# EAGLE schematic wordClock (EAGLE 6.3)
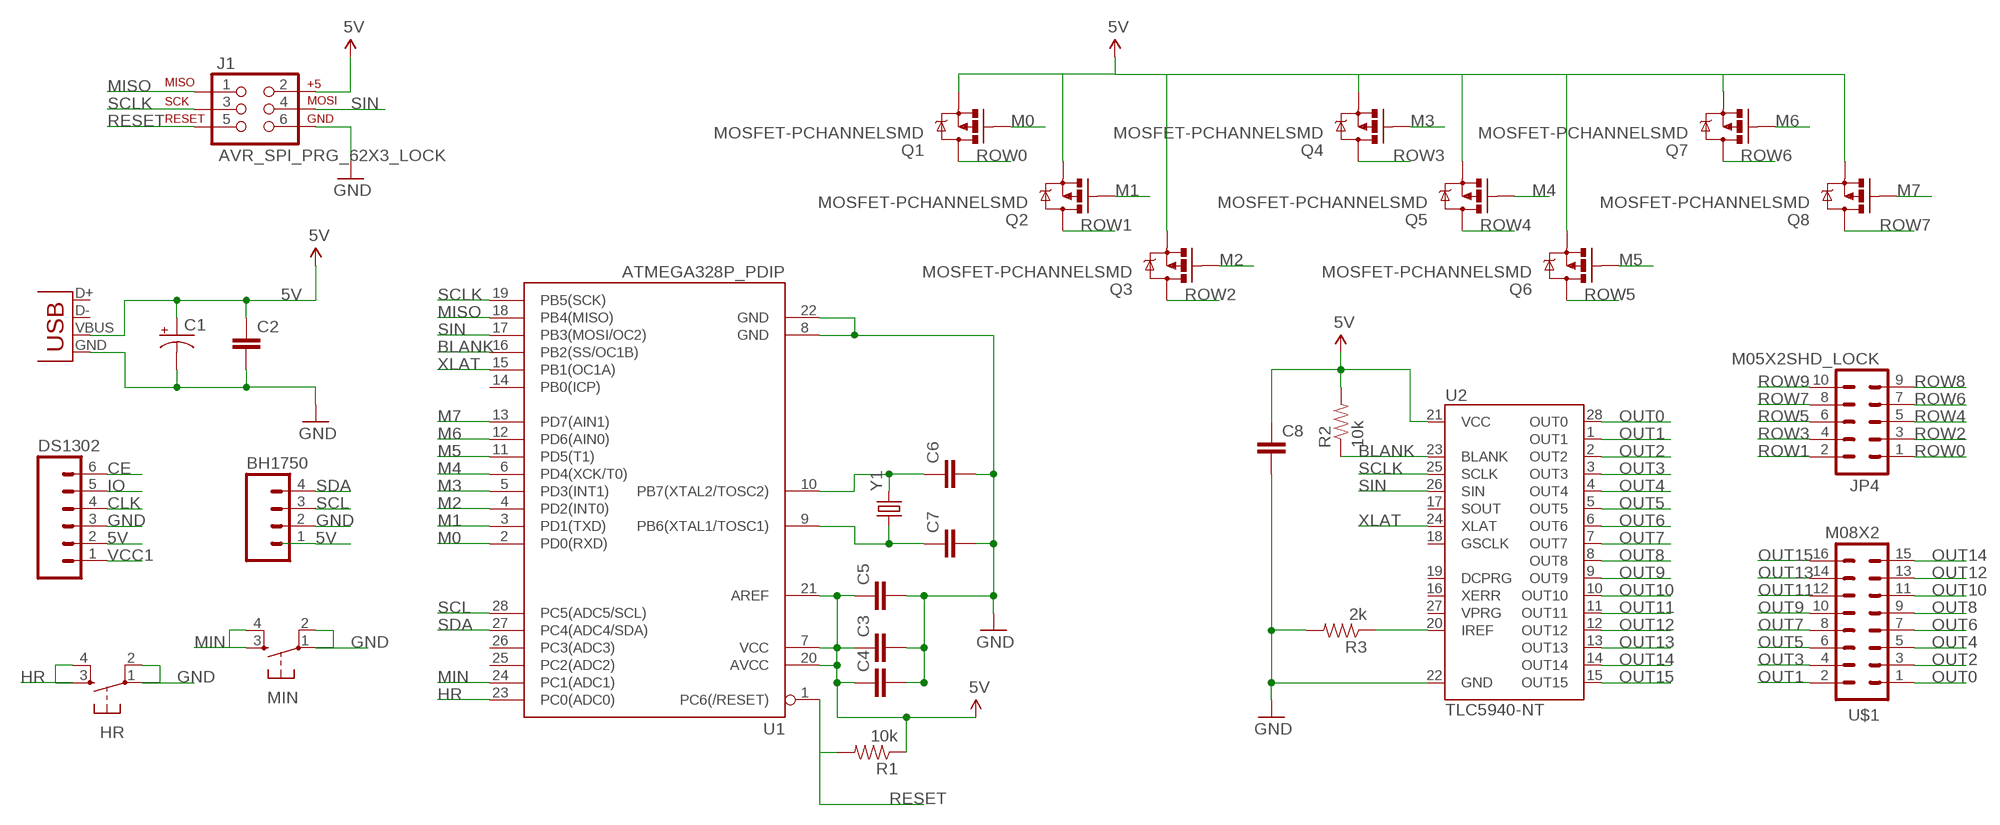
[diagram p0: schematic, sheet 1]

## Parts
BH1750  M04LOCK  [1X04_LOCK]
C1  CAP_POLD  [PANASONIC_D]
C2  CAP0805  [0805]
C3  CAP0805  [0805]
C4  CAP0805  [0805]
C5  CAP0805  [0805]
C6  CAP0805  [0805]
C7  CAP0805  [0805]
C8  CAP0805  [0805]
DS1302  M06LOCK  [1X06_LOCK]
HR  TAC_SWITCHPTH  [TACTILE-PTH]
J1  AVR_SPI_PRG_62X3_LOCK  [2X3_LOCK]
JP1  USBPTH-VERTICAL  [USB-B-PTH-VERTICAL]
JP4  M05X2SHD_LOCK  [2X5-SHROUDED_LOCK]
MIN  TAC_SWITCHPTH  [TACTILE-PTH]
Q1  MOSFET-PCHANNELSMD  [SOT23-3]
Q2  MOSFET-PCHANNELSMD  [SOT23-3]
Q3  MOSFET-PCHANNELSMD  [SOT23-3]
Q4  MOSFET-PCHANNELSMD  [SOT23-3]
Q5  MOSFET-PCHANNELSMD  [SOT23-3]
Q6  MOSFET-PCHANNELSMD  [SOT23-3]
Q7  MOSFET-PCHANNELSMD  [SOT23-3]
Q8  MOSFET-PCHANNELSMD  [SOT23-3]
R1  10k  RESISTOR0805-RES  [0805]
R2  10k  RESISTOR0805-RES  [0805]
R3  2k  RESISTOR0805-RES  [0805]
U1  ATMEGA328P_PDIP  [DIL28-3]
U2  TLC5940-NT  [DIL28-3]
U$1  M08X2  [2X8]
Y1  CRYSTALSMD  [HC49UP]

## Nets
5V: BH1750.1 C1.+ C2.1 C3.1 C4.1 C5.1 C8.1 DS1302.2 J1.2 JP1.VBUS Q1.2(S) Q2.2(S) Q3.2(S) Q4.2(S) Q5.2(S) Q6.2(S) Q7.2(S) Q8.2(S) R1.1 R2.2 U1.7(VCC) U1.20(AVCC) U1.21(AREF) U2.21(VCC)
BLANK: R2.1 U1.16(PB2(SS/OC1B)) U2.23(BLANK)
CE: DS1302.6
CLK: DS1302.4
GND: BH1750.2 C1.- C2.2 C3.2 C4.2 C5.2 C6.2 C7.2 C8.2 DS1302.3 HR.1 HR.2 J1.6 JP1.GND MIN.1 MIN.2 R3.2 U1.8(GND) U1.22(GND) U2.22(GND)
HR: HR.3 HR.4 U1.23(PC0(ADC0))
IO: DS1302.5
M0: Q1.1(G) U1.2(PD0(RXD))
M1: Q2.1(G) U1.3(PD1(TXD))
M2: Q3.1(G) U1.4(PD2(INT0))
M3: Q4.1(G) U1.5(PD3(INT1))
M4: Q5.1(G) U1.6(PD4(XCK/T0))
M5: Q6.1(G) U1.11(PD5(T1))
M6: Q7.1(G) U1.12(PD6(AIN0))
M7: Q8.1(G) U1.13(PD7(AIN1))
MIN: MIN.3 MIN.4 U1.24(PC1(ADC1))
MISO: J1.1 U1.18(PB4(MISO))
N$1: R3.1 U2.20(IREF)
N$2: C6.1 U1.10(PB7(XTAL2/TOSC2)) Y1.2
N$4: C7.1 U1.9(PB6(XTAL1/TOSC1)) Y1.1
OUT0: U2.28(OUT0) U$1.1
OUT1: U2.1(OUT1) U$1.2
OUT2: U2.2(OUT2) U$1.3
OUT3: U2.3(OUT3) U$1.4
OUT4: U2.4(OUT4) U$1.5
OUT5: U2.5(OUT5) U$1.6
OUT6: U2.6(OUT6) U$1.7
OUT7: U2.7(OUT7) U$1.8
OUT8: U2.8(OUT8) U$1.9
OUT9: U2.9(OUT9) U$1.10
OUT10: U2.10(OUT10) U$1.11
OUT11: U2.11(OUT11) U$1.12
OUT12: U2.12(OUT12) U$1.13
OUT13: U2.13(OUT13) U$1.14
OUT14: U2.14(OUT14) U$1.15
OUT15: U2.15(OUT15) U$1.16
RESET: J1.5 R1.2 U1.1(PC6(/RESET))
ROW0: JP4.1 Q1.3(D)
ROW1: JP4.2 Q2.3(D)
ROW2: JP4.3 Q3.3(D)
ROW3: JP4.4 Q4.3(D)
ROW4: JP4.5 Q5.3(D)
ROW5: JP4.6 Q6.3(D)
ROW6: JP4.7 Q7.3(D)
ROW7: JP4.8 Q8.3(D)
ROW8: JP4.9
ROW9: JP4.10
SCL: BH1750.3 U1.28(PC5(ADC5/SCL))
SCLK: J1.3 U1.19(PB5(SCK)) U2.25(SCLK)
SDA: BH1750.4 U1.27(PC4(ADC4/SDA))
SIN: J1.4 U1.17(PB3(MOSI/OC2)) U2.26(SIN)
VCC1: DS1302.1
XLAT: U1.15(PB1(OC1A)) U2.24(XLAT)
Unconnected: JP1.D+ JP1.D- U1.14(PB0(ICP)) U1.25(PC2(ADC2)) U1.26(PC3(ADC3)) U2.16(XERR) U2.17(SOUT) U2.18(GSCLK) U2.19(DCPRG) U2.27(VPRG)

## Library data of the parts
BH1750 = SparkFun-Connectors:M04: Header 4 Standard 4-pin 0.1" header. Use with straight break away headers (SKU : PRT-00116), right angle break away headers (PRT-00553), swiss pins (PRT-00743), machine pins (PRT-00117), and female headers (PRT-00115). Molex polarized connector foot print use with SKU : PRT-08231 with associated crimp pins and housings. 1MM SMD Version SKU: PRT-10208
C1 = SparkFun-Passives:CAP_POL: Capacitor Polarized These are standard SMD and PTH capacitors. Normally 10uF, 47uF, and 100uF in electrolytic and tantalum varieties. Always verify the external diameter of the through hole cap, it varies with capacity, voltage, and manufacturer. The EIA devices should be standard.
C2-C8 = SparkFun-Passives:CAP: Capacitor Standard 0603 ceramic capacitor, and 0.1" leaded capacitor.
DS1302 = SparkFun-Connectors:M06: Header 6 Standard 6-pin 0.1" header. Use with straight break away headers (SKU : PRT-00116), right angle break away headers (PRT-00553), swiss pins (PRT-00743), machine pins (PRT-00117), and female headers (PRT-00115). Molex polarized connector foot print use with SKU : PRT-08094 with associated crimp pins and housings. NOTES ON THE VARIANTS LOCK and LOCK_LONGPADS... This footprint was designed to help hold the alignment of a through-hole component (i.e. 6-pin header) while soldering it into place. You may notice that each hole has been shifted either up or down by 0.005 of an inch from it's more standard position (which is a perfectly straight line). This slight alteration caused the pins (the squares in the middle) to touch the edges of the holes. Because they are alternating, it causes a "brace" to hold the component in place. 0.005 has proven to be the perfect amount of "off-center" position when using our standard breakaway headers. Although looks a little odd when you look at the bare footprint, once you have a header in there, the alteration is very hard to notice. Also, if you push a header all the way into place, it is covered up entirely on the bottom side. This idea of altering the position of holes to aid alignment will be further integrated into the Sparkfun Library for other footprints. It can help hold any component with 3 or more connection pins.
HR MIN = SparkFun-Electromechanical:TAC_SWITCH: Momentary Switch Button commonly used for reset or general input. Spark Fun Electronics SKU : COM-00097 SMT- SWCH-08247
J1 = SparkFun-Connectors:AVR_SPI_PRG_6: AVR ISP 6 Pin This is the reduced ISP connector for AVR programming. Common on Arduino. This footprint will take up less PCB space and can be used with a 10-pin to 6-pin adapter such as SKU: BOB-08508
JP1 = SparkFun-Connectors:USB: USB Connectors USB-B-PTH is fully proven SKU : PRT-00139/CONN-08278 USB-miniB is fully proven SKU : PRT-00587 USB-A-PCB is untested. USB-A-H is throughly reviewed, but untested. Spark Fun Electronics SKU : PRT-00437 USB-B-SMT is throughly reviewed, but untested. Needs silkscreen touching up. USB-A-S has not been used/tested USB-MB-H has not been used/tested USB-MICROB has been used. CONN-09505
JP4 = SparkFun-Connectors:M05X2: Header 5x2 Standard 10-pin dual row 0.1" header. Commonly used with AVR-ISP. Use with Spark Fun Electronics SKU: PRT-00778
Q1-Q8 = SparkFun-DiscreteSemi:MOSFET-PCHANNEL: Generic PMOSFET
R1-R3 = SparkFun-Passives:RESISTOR: Resistor Basic schematic elements and footprints for 0603, 1206, and PTH resistors.
U1 = SparkFun-DigitalIC:ATMEGA328P_PDIP: uC used in the Arduino 32kb flash, 1k EEPROM, 2k SRAM This is the through-hole version of this chip.
U2 = SparkFun-DigitalIC:TLC5940: 16-channel LED Driver with Dot Correction and Grayscale PWM Control The TLC5940 is a 16-channel, constant-current sink LED driver. Each channel has an individually adjustable 4096-step grayscale PWM brightness control and a 64-step, constant-current sink (dot correction). The dot correction adjusts the brightness variations between LED channels and other LED drivers. The dot correction data is stored in an integrated EEPROM. Both grayscale control and dot correction are accessible via a serial interface. A single external resistor sets the maximum current value of all 16 channels. Packages: 28-pin HTSSOP 32-pin 5x5mm QFN 28-pin DIP
U$1 = SparkFun-Connectors:M08X2: .1" headers, two rows of 8 each
Y1 = SparkFun-FreqCtrl:CRYSTAL: Various standard crystals. Proven footprints. Spark Fun Electronics SKU : COM-00534